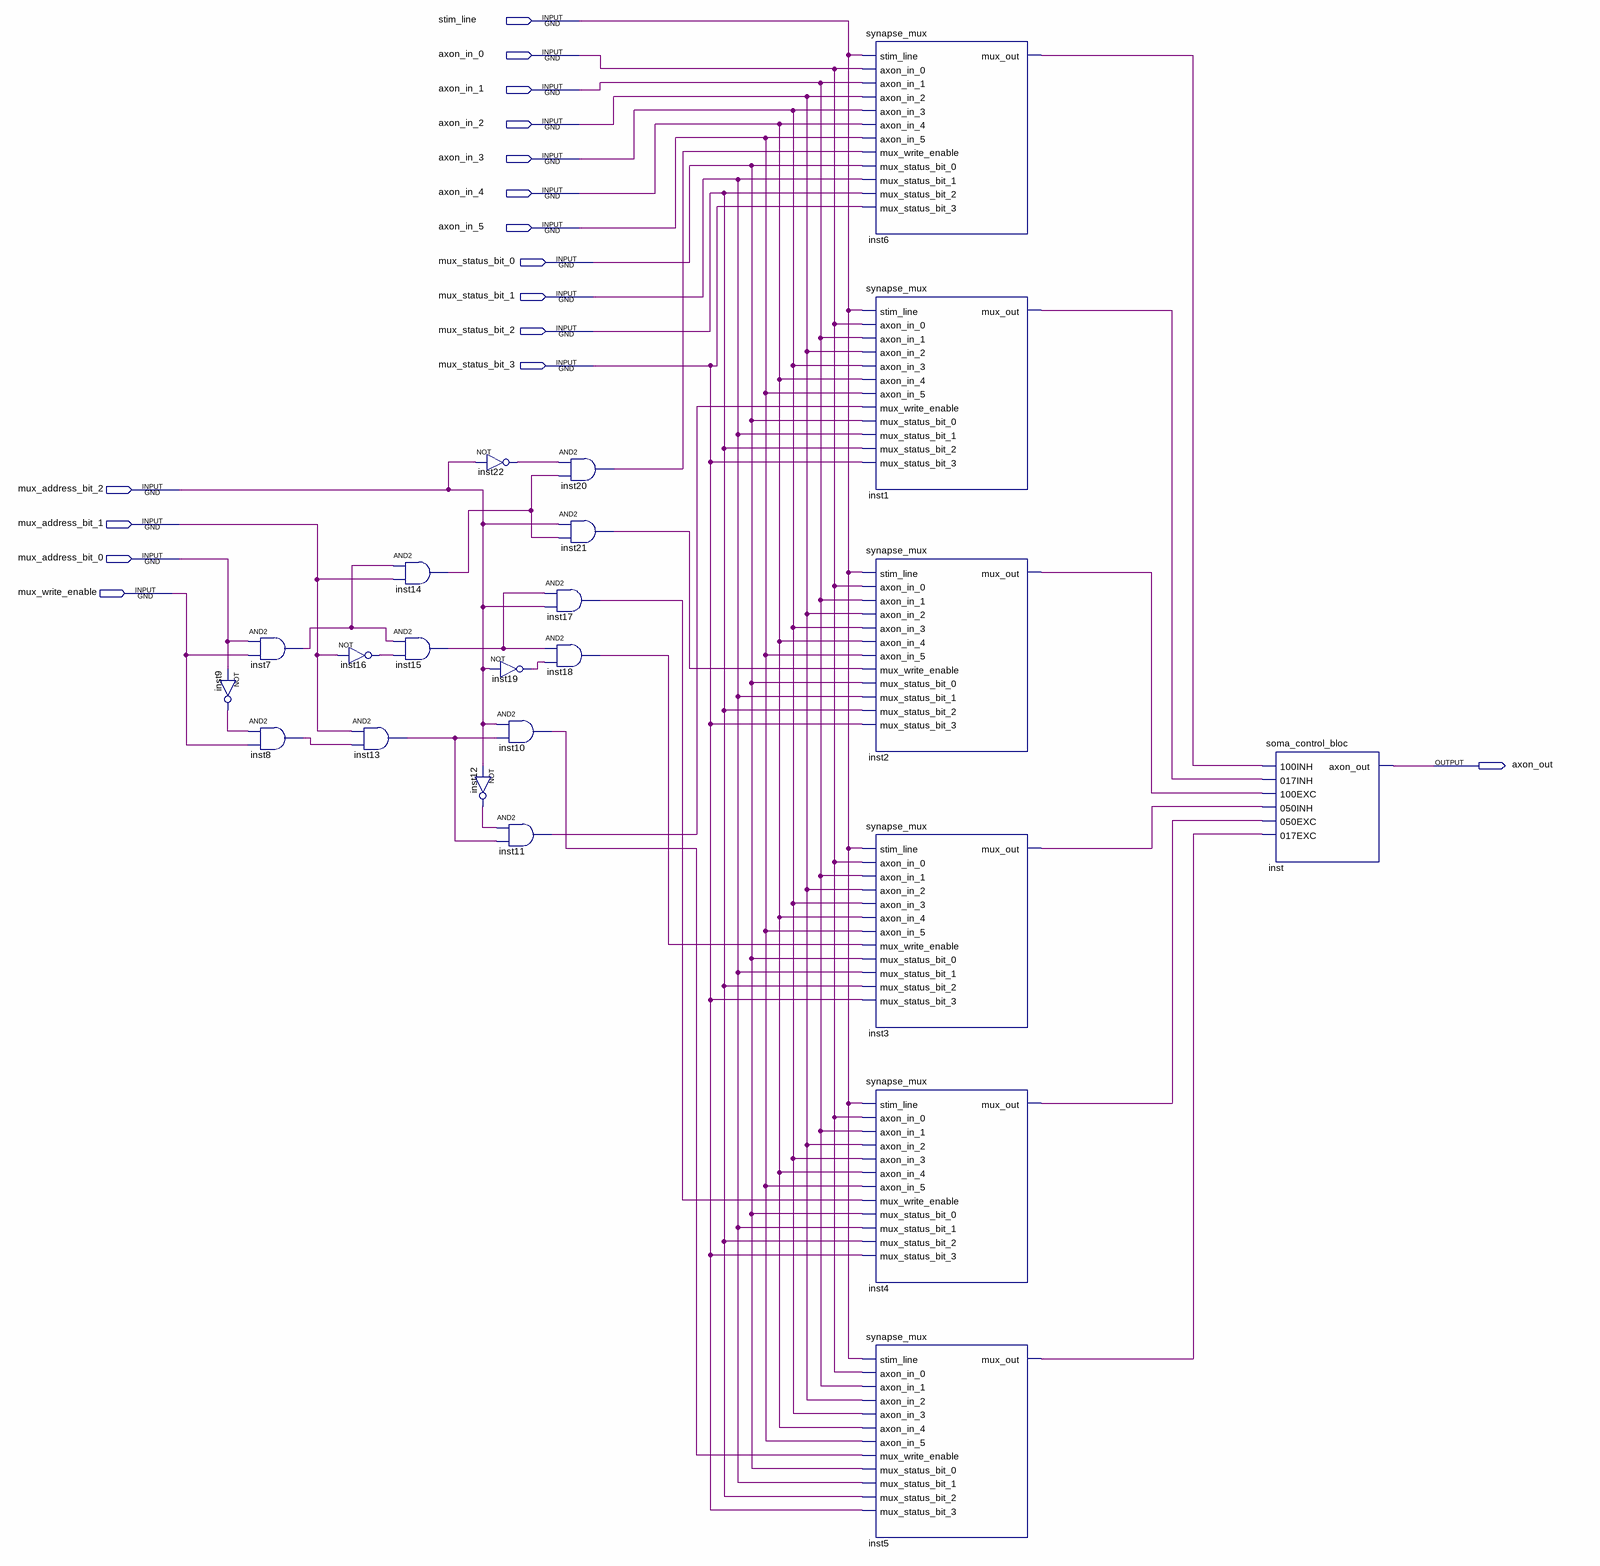
[diagram p0: schematic sheet]
// Quartus schematic full_neuron.bdf as structural Verilog: 23 symbols, 16 pins
module full_neuron (
  input  stim_line,
  input  axon_in_0,
  input  axon_in_1,
  input  axon_in_2,
  input  axon_in_3,
  input  axon_in_4,
  input  axon_in_5,
  input  mux_status_bit_0,
  input  mux_status_bit_1,
  input  mux_status_bit_2,
  input  mux_status_bit_3,
  input  mux_address_bit_2,
  input  mux_address_bit_1,
  input  mux_address_bit_0,
  input  mux_write_enable,
  output axon_out
);

  wire inst1_mux_out, inst2_mux_out, inst3_mux_out, inst4_mux_out, inst5_mux_out, inst6_mux_out, inst7_out,
       inst8_out, inst9_out, inst10_out, inst11_out, inst12_out, inst13_out, inst14_out, inst15_out,
       inst16_out, inst17_out, inst18_out, inst19_out, inst20_out, inst21_out, inst22_out;

  not inst9 (inst9_out, mux_address_bit_0);
  and inst7 (inst7_out, mux_address_bit_0, mux_write_enable);
  and inst8 (inst8_out, inst9_out, mux_write_enable);
  not inst16 (inst16_out, mux_address_bit_1);
  and inst14 (inst14_out, inst7_out, mux_address_bit_1);
  and inst15 (inst15_out, inst7_out, inst16_out);
  and inst13 (inst13_out, mux_address_bit_1, inst8_out);
  not inst22 (inst22_out, mux_address_bit_2);
  not inst19 (inst19_out, mux_address_bit_2);
  and inst10 (inst10_out, mux_address_bit_2, inst13_out);
  not inst12 (inst12_out, mux_address_bit_2);
  and inst11 (inst11_out, inst12_out, inst13_out);
  and inst20 (inst20_out, inst22_out, inst14_out);
  and inst21 (inst21_out, mux_address_bit_2, inst14_out);
  and inst17 (inst17_out, inst15_out, mux_address_bit_2);
  and inst18 (inst18_out, inst15_out, inst19_out);
  synapse_mux inst6 (
    .stim_line(stim_line), .axon_in_0(axon_in_0), .axon_in_1(axon_in_1), .axon_in_2(axon_in_2),
    .axon_in_3(axon_in_3), .axon_in_4(axon_in_4), .axon_in_5(axon_in_5), .mux_write_enable(inst20_out),
    .mux_status_bit_0(mux_status_bit_0), .mux_status_bit_1(mux_status_bit_1),
    .mux_status_bit_2(mux_status_bit_2), .mux_status_bit_3(mux_status_bit_3), .mux_out(inst6_mux_out));
  synapse_mux inst1 (
    .stim_line(stim_line), .axon_in_0(axon_in_0), .axon_in_1(axon_in_1), .axon_in_2(axon_in_2),
    .axon_in_3(axon_in_3), .axon_in_4(axon_in_4), .axon_in_5(axon_in_5), .mux_write_enable(inst11_out),
    .mux_status_bit_0(mux_status_bit_0), .mux_status_bit_1(mux_status_bit_1),
    .mux_status_bit_2(mux_status_bit_2), .mux_status_bit_3(mux_status_bit_3), .mux_out(inst1_mux_out));
  synapse_mux inst2 (
    .stim_line(stim_line), .axon_in_0(axon_in_0), .axon_in_1(axon_in_1), .axon_in_2(axon_in_2),
    .axon_in_3(axon_in_3), .axon_in_4(axon_in_4), .axon_in_5(axon_in_5), .mux_write_enable(inst21_out),
    .mux_status_bit_0(mux_status_bit_0), .mux_status_bit_1(mux_status_bit_1),
    .mux_status_bit_2(mux_status_bit_2), .mux_status_bit_3(mux_status_bit_3), .mux_out(inst2_mux_out));
  synapse_mux inst3 (
    .stim_line(stim_line), .axon_in_0(axon_in_0), .axon_in_1(axon_in_1), .axon_in_2(axon_in_2),
    .axon_in_3(axon_in_3), .axon_in_4(axon_in_4), .axon_in_5(axon_in_5), .mux_write_enable(inst18_out),
    .mux_status_bit_0(mux_status_bit_0), .mux_status_bit_1(mux_status_bit_1),
    .mux_status_bit_2(mux_status_bit_2), .mux_status_bit_3(mux_status_bit_3), .mux_out(inst3_mux_out));
  synapse_mux inst4 (
    .stim_line(stim_line), .axon_in_0(axon_in_0), .axon_in_1(axon_in_1), .axon_in_2(axon_in_2),
    .axon_in_3(axon_in_3), .axon_in_4(axon_in_4), .axon_in_5(axon_in_5), .mux_write_enable(inst17_out),
    .mux_status_bit_0(mux_status_bit_0), .mux_status_bit_1(mux_status_bit_1),
    .mux_status_bit_2(mux_status_bit_2), .mux_status_bit_3(mux_status_bit_3), .mux_out(inst4_mux_out));
  synapse_mux inst5 (
    .stim_line(stim_line), .axon_in_0(axon_in_0), .axon_in_1(axon_in_1), .axon_in_2(axon_in_2),
    .axon_in_3(axon_in_3), .axon_in_4(axon_in_4), .axon_in_5(axon_in_5), .mux_write_enable(inst10_out),
    .mux_status_bit_0(mux_status_bit_0), .mux_status_bit_1(mux_status_bit_1),
    .mux_status_bit_2(mux_status_bit_2), .mux_status_bit_3(mux_status_bit_3), .mux_out(inst5_mux_out));
  soma_control_bloc inst (
    .\100INH (inst6_mux_out), .\017INH (inst1_mux_out), .\100EXC (inst2_mux_out), .\050INH (inst3_mux_out),
    .\050EXC (inst4_mux_out), .\017EXC (inst5_mux_out), .axon_out(axon_out));
endmodule
